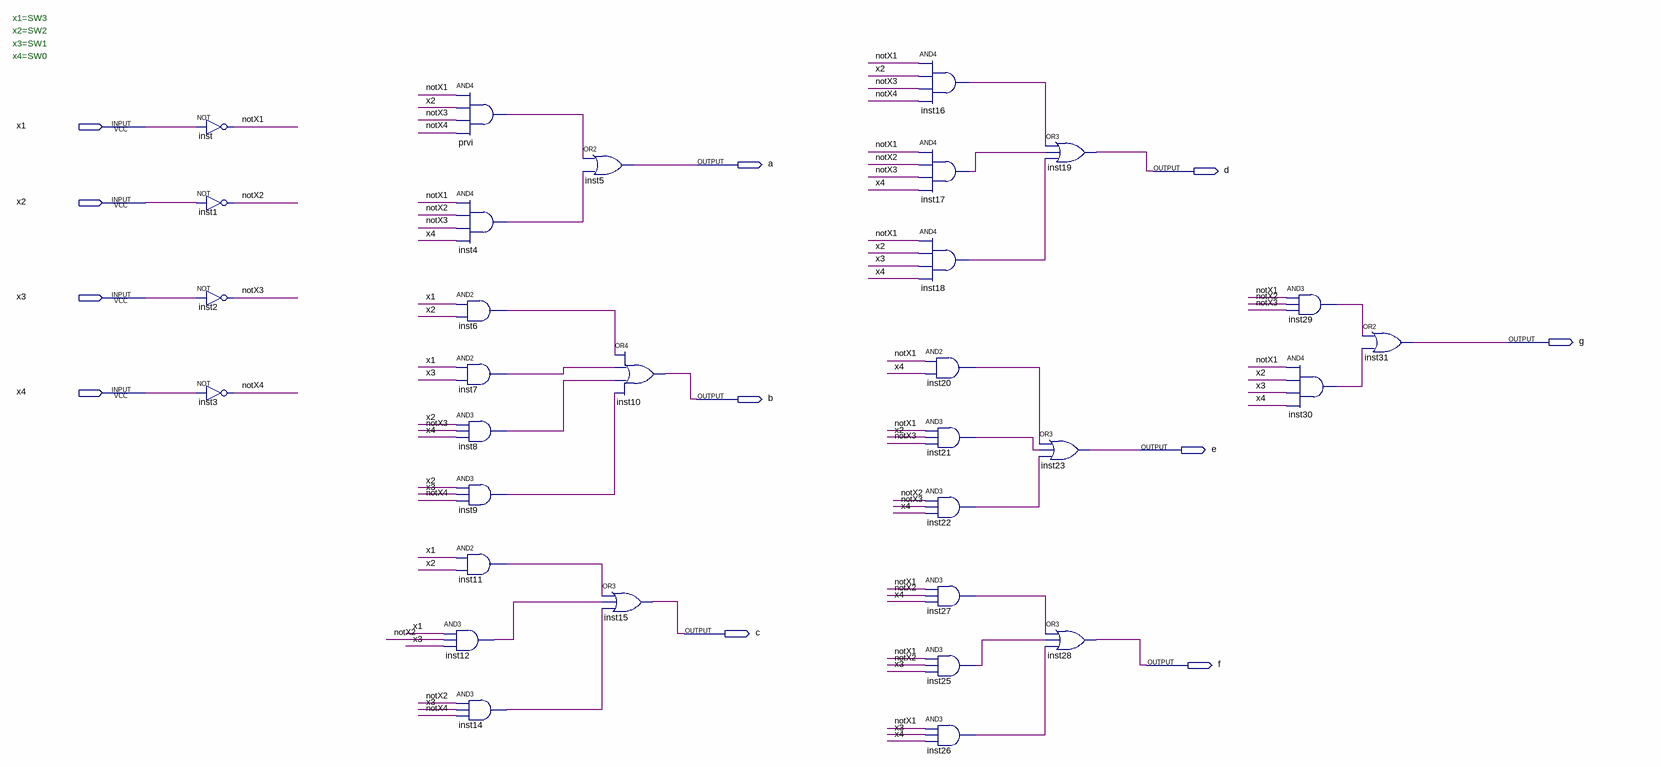
[diagram p0: schematic sheet]
// Quartus schematic domaci1.bdf as structural Verilog: 31 symbols, 11 pins
module domaci1 (
  input  x1,
  input  x2,
  input  x3,
  input  x4,
  output a,
  output d,
  output g,
  output b,
  output e,
  output c,
  output f
);

  wire inst4_out, inst6_out, inst7_out, inst8_out, inst9_out, inst11_out, inst12_out, inst14_out, inst16_out,
       inst17_out, inst18_out, inst20_out, inst21_out, inst22_out, inst25_out, inst26_out, inst27_out,
       inst29_out, inst30_out, notX1, notX2, notX3, notX4, prvi_out;

  not inst (notX1, x1);
  not inst1 (notX2, x2);
  not inst2 (notX3, x3);
  not inst3 (notX4, x4);
  and prvi (prvi_out, notX1, x2, notX3, notX4);
  and inst4 (inst4_out, notX1, notX2, notX3, x4);
  and inst6 (inst6_out, x1, x2);
  and inst7 (inst7_out, x1, x3);
  and inst8 (inst8_out, x2, notX3, x4);
  and inst9 (inst9_out, x2, x3, notX4);
  and inst11 (inst11_out, x1, x2);
  and inst12 (inst12_out, x1, notX2, x3);
  and inst14 (inst14_out, notX2, x3, notX4);
  or inst5 (a, prvi_out, inst4_out);
  or inst10 (b, inst6_out, inst7_out, inst8_out, inst9_out);
  or inst15 (c, inst11_out, inst12_out, inst14_out);
  and inst16 (inst16_out, notX1, x2, notX3, notX4);
  and inst17 (inst17_out, notX1, notX2, notX3, x4);
  and inst18 (inst18_out, notX1, x2, x3, x4);
  and inst20 (inst20_out, notX1, x4);
  and inst21 (inst21_out, notX1, x2, notX3);
  and inst22 (inst22_out, notX2, notX3, x4);
  and inst27 (inst27_out, notX1, notX2, x4);
  and inst25 (inst25_out, notX1, notX2, x3);
  and inst26 (inst26_out, notX1, x3, x4);
  or inst19 (d, inst16_out, inst17_out, inst18_out);
  or inst23 (e, inst20_out, inst21_out, inst22_out);
  or inst28 (f, inst27_out, inst25_out, inst26_out);
  and inst29 (inst29_out, notX1, notX2, notX3);
  and inst30 (inst30_out, notX1, x2, x3, x4);
  or inst31 (g, inst29_out, inst30_out);

  // Notes on the sheet:
  //   x1=SW3
  //   x2=SW2
  //   x3=SW1
  //   x4=SW0
endmodule
